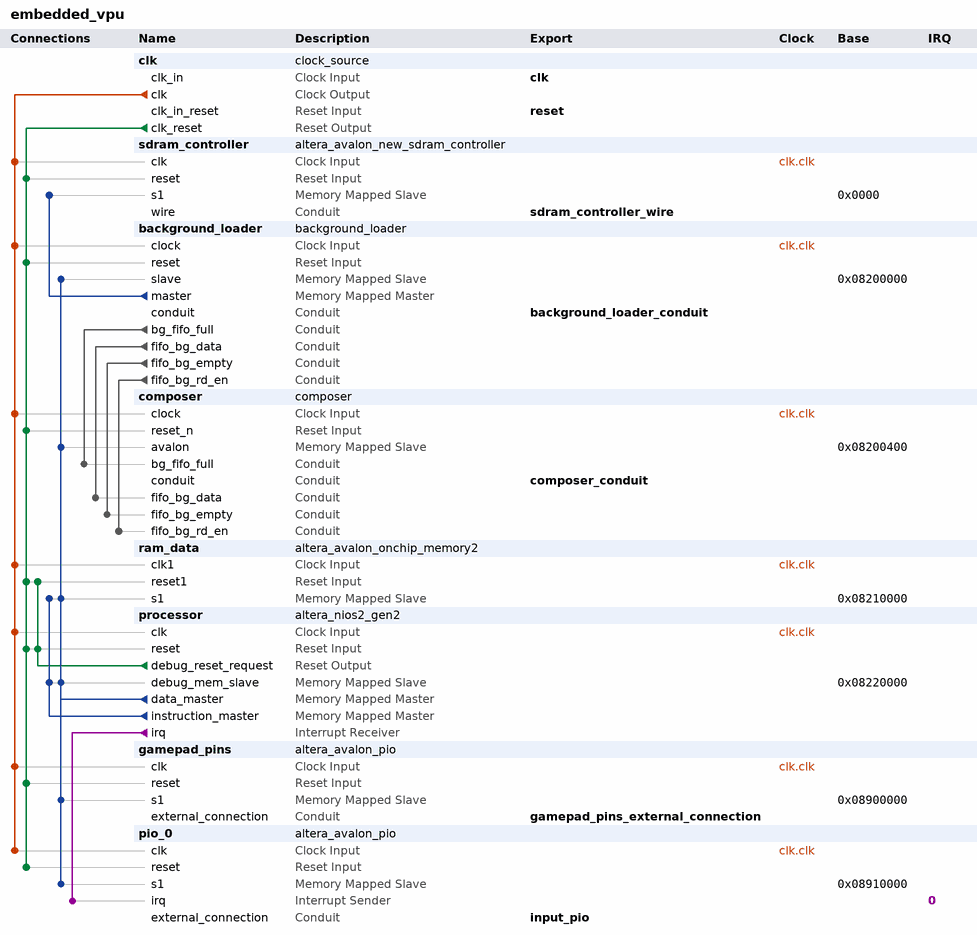
[diagram p0: system contents]
# Platform Designer (Qsys) system embedded_vpu, Cyclone IV E EP4CE115F29C7
# Parameters at their usual value, and those the tool derives, are not listed.
package require -exact qsys 18.1
create_system embedded_vpu
set_project_property DEVICE_FAMILY {Cyclone IV E}
set_project_property DEVICE EP4CE115F29C7

add_instance clk clock_source 18.1
set_instance_parameter_value clk clockFrequency 100000000

add_instance sdram_controller altera_avalon_new_sdram_controller 18.1
set_instance_parameter_value sdram_controller TAC 5.5
set_instance_parameter_value sdram_controller TRCD 20.0
set_instance_parameter_value sdram_controller TRP 20.0
set_instance_parameter_value sdram_controller casLatency 2
set_instance_parameter_value sdram_controller columnWidth 10
set_instance_parameter_value sdram_controller dataWidth 32
set_instance_parameter_value sdram_controller generateSimulationModel true
set_instance_parameter_value sdram_controller model single_Micron_MT48LC4M32B2_7_chip
set_instance_parameter_value sdram_controller numberOfBanks 4
set_instance_parameter_value sdram_controller numberOfChipSelects 1
set_instance_parameter_value sdram_controller powerUpDelay 200.0
set_instance_parameter_value sdram_controller refreshPeriod 7.8125
set_instance_parameter_value sdram_controller rowWidth 13

add_instance background_loader background_loader 1.0

add_instance composer composer 1.0

add_instance ram_data altera_avalon_onchip_memory2 18.1
set_instance_parameter_value ram_data dataWidth 32
set_instance_parameter_value ram_data dualPort false
set_instance_parameter_value ram_data initMemContent true
set_instance_parameter_value ram_data initializationFileName onchip_mem.hex
set_instance_parameter_value ram_data memorySize 65536

add_instance processor altera_nios2_gen2 18.1
set_instance_parameter_value processor dcache_size 2048
set_instance_parameter_value processor exceptionSlave ram_data.s1
set_instance_parameter_value processor icache_size 4096
set_instance_parameter_value processor impl Tiny
set_instance_parameter_value processor resetSlave ram_data.s1

add_instance gamepad_pins altera_avalon_pio 18.1
set_instance_parameter_value gamepad_pins direction Input
set_instance_parameter_value gamepad_pins width 12

add_instance pio_0 altera_avalon_pio 18.1
set_instance_parameter_value pio_0 captureEdge true
set_instance_parameter_value pio_0 direction Input
set_instance_parameter_value pio_0 generateIRQ true
set_instance_parameter_value pio_0 irqType EDGE
set_instance_parameter_value pio_0 width 1

# connections
add_connection clk.clk background_loader.clock clock
add_connection clk.clk composer.clock clock
add_connection clk.clk gamepad_pins.clk clock
add_connection clk.clk pio_0.clk clock
add_connection clk.clk processor.clk clock
add_connection clk.clk ram_data.clk1 clock
add_connection clk.clk sdram_controller.clk clock
add_connection clk.clk_reset background_loader.reset reset
add_connection clk.clk_reset composer.reset_n reset
add_connection clk.clk_reset gamepad_pins.reset reset
add_connection clk.clk_reset pio_0.reset reset
add_connection clk.clk_reset processor.reset reset
add_connection clk.clk_reset ram_data.reset1 reset
add_connection clk.clk_reset sdram_controller.reset reset
add_connection processor.debug_reset_request processor.reset reset
add_connection processor.debug_reset_request ram_data.reset1 reset
add_connection background_loader.master sdram_controller.s1 avalon
set_connection_parameter_value background_loader.master/sdram_controller.s1 baseAddress 0x0000
add_connection processor.data_master background_loader.slave avalon
set_connection_parameter_value processor.data_master/background_loader.slave baseAddress 0x08200000
add_connection processor.data_master composer.avalon avalon
set_connection_parameter_value processor.data_master/composer.avalon baseAddress 0x08200400
add_connection processor.data_master gamepad_pins.s1 avalon
set_connection_parameter_value processor.data_master/gamepad_pins.s1 baseAddress 0x08900000
add_connection processor.data_master pio_0.s1 avalon
set_connection_parameter_value processor.data_master/pio_0.s1 baseAddress 0x08910000
add_connection processor.data_master processor.debug_mem_slave avalon
set_connection_parameter_value processor.data_master/processor.debug_mem_slave baseAddress 0x08220000
add_connection processor.data_master ram_data.s1 avalon
set_connection_parameter_value processor.data_master/ram_data.s1 baseAddress 0x08210000
add_connection processor.instruction_master processor.debug_mem_slave avalon
set_connection_parameter_value processor.instruction_master/processor.debug_mem_slave baseAddress 0x08220000
add_connection processor.instruction_master ram_data.s1 avalon
set_connection_parameter_value processor.instruction_master/ram_data.s1 baseAddress 0x08210000
add_connection background_loader.bg_fifo_full composer.bg_fifo_full conduit
add_connection background_loader.fifo_bg_data composer.fifo_bg_data conduit
add_connection background_loader.fifo_bg_empty composer.fifo_bg_empty conduit
add_connection background_loader.fifo_bg_rd_en composer.fifo_bg_rd_en conduit
add_connection processor.irq pio_0.irq interrupt
set_connection_parameter_value processor.irq/pio_0.irq irqNumber 0

# exported interfaces
add_interface background_loader_conduit conduit end
set_interface_property background_loader_conduit EXPORT_OF background_loader.conduit
add_interface clk clock sink
set_interface_property clk EXPORT_OF clk.clk_in
add_interface composer_conduit conduit end
set_interface_property composer_conduit EXPORT_OF composer.conduit
add_interface gamepad_pins_external_connection conduit end
set_interface_property gamepad_pins_external_connection EXPORT_OF gamepad_pins.external_connection
add_interface input_pio conduit end
set_interface_property input_pio EXPORT_OF pio_0.external_connection
add_interface reset reset sink
set_interface_property reset EXPORT_OF clk.clk_in_reset
add_interface sdram_controller_wire conduit end
set_interface_property sdram_controller_wire EXPORT_OF sdram_controller.wire

set_interconnect_requirement {$system} qsys_mm.clockCrossingAdapter AUTO
set_interconnect_requirement {$system} qsys_mm.enableEccProtection FALSE
set_interconnect_requirement {$system} qsys_mm.insertDefaultSlave FALSE
set_interconnect_requirement {$system} qsys_mm.maxAdditionalLatency 1

save_system embedded_vpu.qsys
